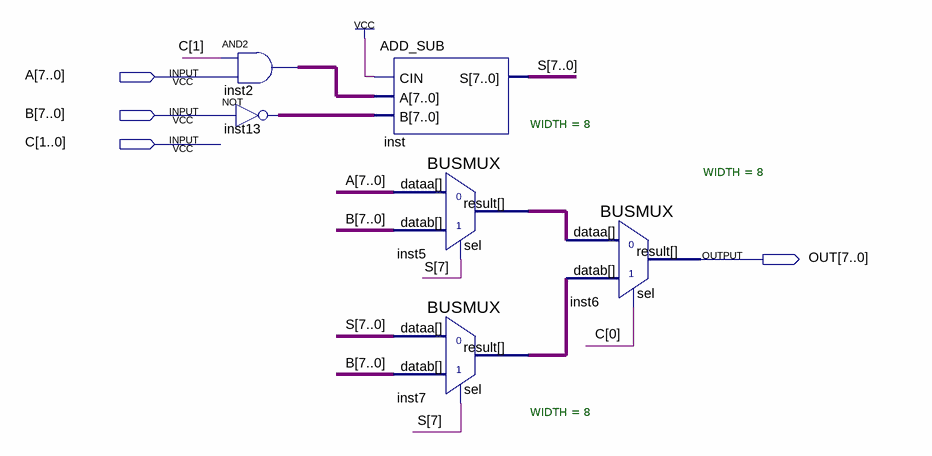
[diagram p0: schematic sheet]
// Quartus schematic MIXUP2.bdf as structural Verilog: 6 symbols, 4 pins
module MIXUP2 (
  input  [7:0] A,
  input  [7:0] B,
  input  [1:0] C,
  output [7:0] OUT
);

  wire [7:0] inst2_out, inst5_result, inst7_result, inst13_out, S;

  assign inst2_out = {8{C[1]}} & A;  // AND2 inst2, 8 bits wide
  assign inst13_out = ~B;  // NOT inst13, 8 bits wide
  ADD_SUB inst (.CIN(1'b1), .A(inst2_out), .B(inst13_out), .S(S));
  BUSMUX #(.WIDTH(8)) inst5 (.datab(B), .sel(S[7]), .dataa(A), .result(inst5_result));
  BUSMUX #(.WIDTH(8)) inst7 (.datab(B), .sel(S[7]), .dataa(S), .result(inst7_result));
  BUSMUX #(.WIDTH(8)) inst6 (.datab(inst7_result), .sel(C[0]), .dataa(inst5_result), .result(OUT));
endmodule
